# EasyEDA schematic schem.json
TITLE: Sheet_1; REV: 1.0; Date: 2024-05-03; Sheet: 1/1; Drawn By: ramgupta1106; Company: Your Company
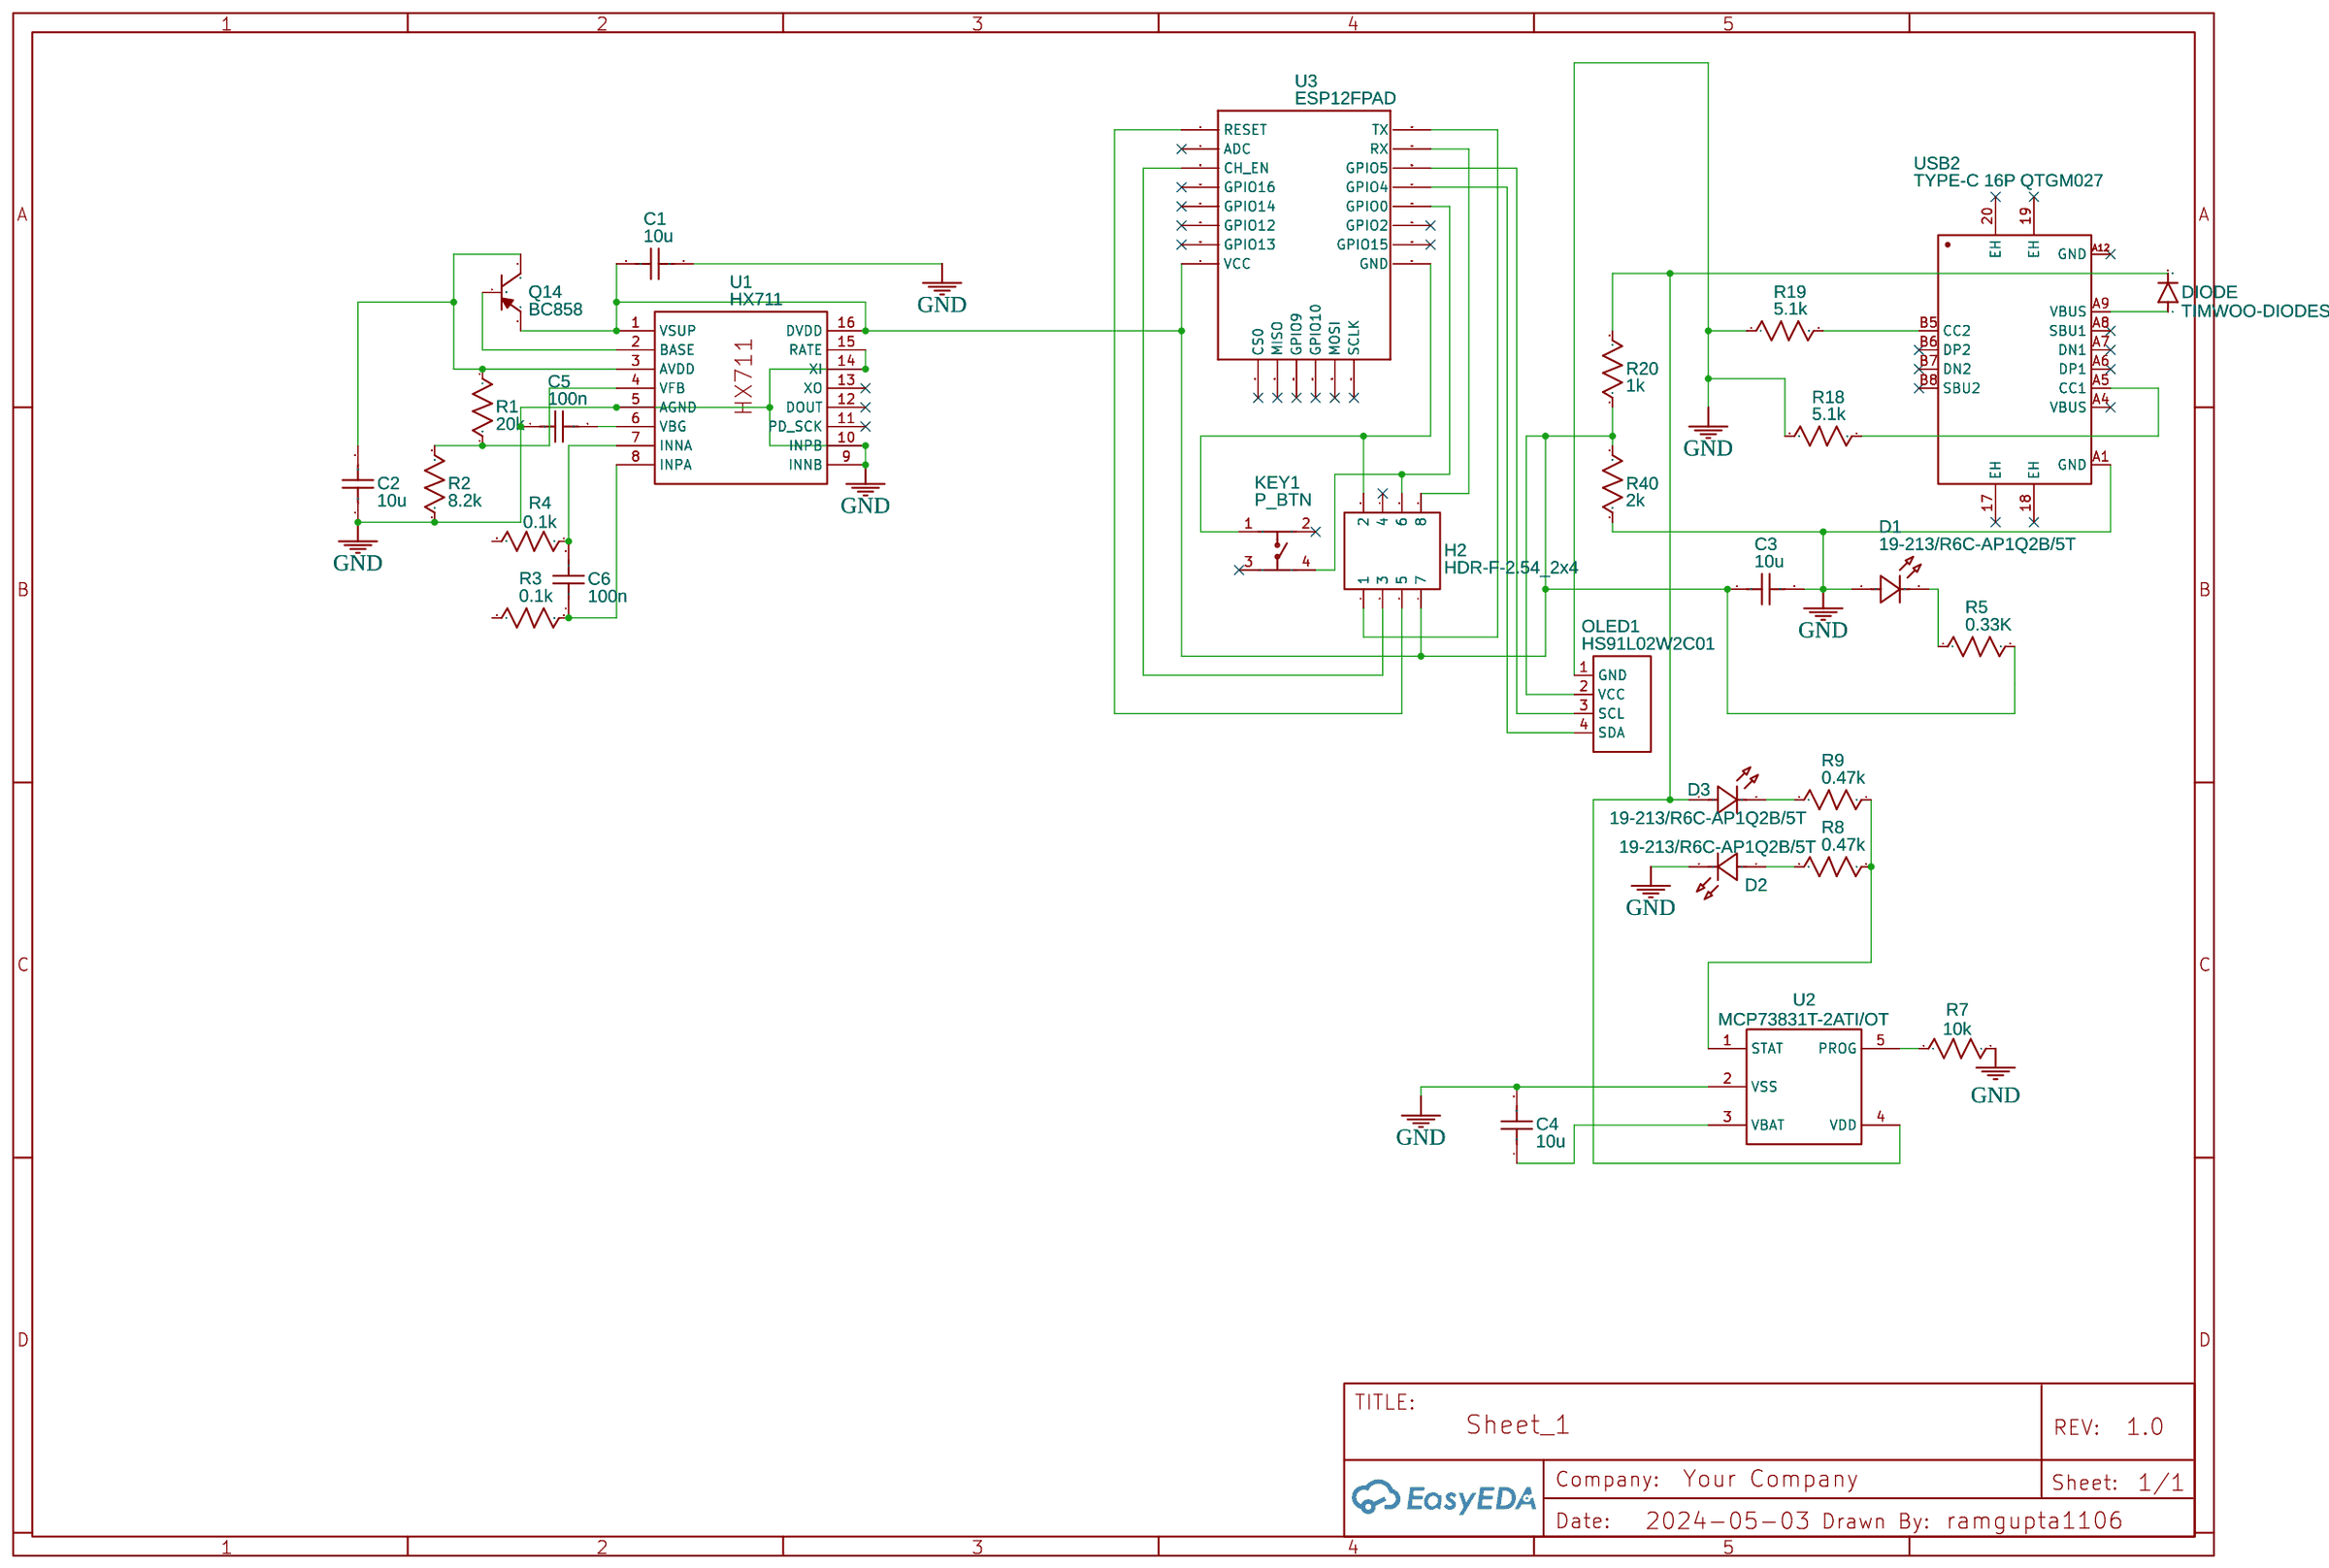
[diagram p0: schematic sheet]

## Parts
C1  10u  [C0603]
C2  10u  [C0603]
C3  10u  [C0603]
C4  10u  [C0603]
C5  100n  [C0603]
C6  100n  [C0603]
D1  19-213/R6C-AP1Q2B/5T  [LED0603-FD]
D2  19-213/R6C-AP1Q2B/5T  [LED0603-FD]
D3  19-213/R6C-AP1Q2B/5T  [LED0603-FD]
DIODE  TIMWOO-DIODES_DIODEHV  [TIMWOO-DIODES_DIODE-HV]
H2  HDR-F-2.54_2x4  [HDR-F-2.54_2X4]
KEY1  P_BTN  [SW-SMD_4P-L6.0-W6.0-P4.50-LS10.0_TL3301EF160QG]
OLED1  HS91L02W2C01  [OLED-TH_L38.0-W12.0_HS91L02W2C01]
Q14  BC858  [SOT-23-3_L2.9-W1.3-P1.90-LS2.4-BR]
R1  20k  [R0603]
R2  8.2k  [R0603]
R3  0.1k  [R0603]
R4  0.1k  [R0603]
R5  0.33K  [R0603]
R7  10k  [R0603]
R8  0.47k  [R0603]
R9  0.47k  [R0603]
R18  5.1k  [R0603]
R19  5.1k  [R0603]
R20  1k  [R0603]
R40  2k  [R0603]
U1  HX711  [SOP-16_L10.0-W3.9-P1.27-LS6.0-BL]
U2  MCP73831T-2ATI/OT  [SOT-23-5_L3.0-W1.7-P0.95-LS2.8-BR]
U3  ESP12FPAD  [ESP12F]
USB2  TYPE-C 16P QTGM027  [USB-C-SMD_TYPE-C-16P-QTGM027]

## Library data of the parts
C1-C6 = C_0603_US: Contributor: LCEDA_Lib
D1-D3 = 19-213/R6C-AP1Q2B/5T: Supplier: LCSC; Supplier Part: C2984264; Manufacturer: EVERLIGHT(亿光); JLCPCB Part Class: Extended Part; Contributor: lcsc
DIODE = TIMWOO-DIODES_DIODEHV: Contributor: moun313131
H2 = HDR-F-2.54_2x4: Supplier Part: C239344; Supplier: LCSC; Contributor: LCEDA_Lib
KEY1 = 4PINTACTPCBTHTPUSHBUTTON: Contributor: LCSC; Supplier: LCSC; Supplier Part: C9900003768; Manufacturer: null; Manufacturer Part: 4pinTACTPCBTHTPushButton; JLCPCB Part Class: Extended Part
OLED1 = HS91L02W2C01: Supplier: LCSC; Supplier Part: C5248081; Manufacturer: HS(汉昇); JLCPCB Part Class: Extended Part; Contributor: lcsc
Q14 = BC858: Contributor: LCSC; Supplier: LCSC; Supplier Part: C692852; Manufacturer: HT(Shenzhen Jinyu Semicon); JLCPCB Part Class: Extended Part
R1-R5 R7-R9 R18-R20 R40 = R_0603_US: Contributor: LCEDA_Lib
U1 = HX711: Supplier: LCSC; Manufacturer: AVIA(海芯科技); Supplier Part: C43656; JLCPCB Part Class: Extended Part
U2 = MCP73831T-2ATI/OT: Supplier: LCSC; Manufacturer: MICROCHIP(美国微芯); Supplier Part: C14879; JLCPCB Part Class: Extended Part
U3 = ESP12FPAD: Contributor: corentindedicast
USB2 = TYPE-C 16P QTGM027: Contributor: LCSC; Supplier: LCSC; Supplier Part: C2681552; Manufacturer: SHOU HAN(首韩); JLCPCB Part Class: Extended Part

## Nets
GND: C1.2 C2.1 C3.2 C4.2 C5.1 D1.1(A) D2.2(K) OLED1.1(GND) R2.1 R7.2 R18.1 R19.1 R40.1 U1.5(AGND) U1.9(INNB) U1.10(INPB) U1.14(XI) U1.15(RATE) U2.2(VSS) USB2.A1(GND)
Net-(C1-1): C1.1 C3.1 H2.7 OLED1.2(VCC) Q14.2(E) R5.2 R20.1 R40.2 U1.1(VSUP) U1.16(DVDD) U3.VCC
Net-(C2-2): C2.2 Q14.3(C) R1.1 U1.3(AVDD)
Net-(C4-1): C4.1 U2.3(VBAT)
Net-(C5-2): C5.2 U1.6(VBG)
Net-(C6-1): C6.1 R3.2 U1.8(INPA)
Net-(C6-2): C6.2 R4.1 U1.7(INNA)
Net-(D1-2): D1.2(K) R5.1
Net-(D2-1): D2.1(A) R8.1
Net-(D3-1): D3.1(A) DIODE.C R20.2 U2.4(VDD)
Net-(D3-2): D3.2(K) R9.1
Net-(DIODE-A): DIODE.A USB2.A9(VBUS)
Net-(H2-1): H2.1 U3.TXD0(TX)
Net-(H2-2): H2.2 KEY1.1 U3.GND
Net-(H2-3): H2.3 U3.CH_PD(CH_EN)
Net-(H2-5): H2.5 U3.RESET
Net-(H2-6): H2.6 KEY1.4 U3.GPIO0
Net-(H2-8): H2.8 U3.RXD0(RX)
Net-(OLED1-3): OLED1.3(SCL) U3.GPIO5
Net-(OLED1-4): OLED1.4(SDA) U3.GPIO4
Net-(Q14-1): Q14.1(B) U1.2(BASE)
Net-(R1-2): R1.2 R2.2 U1.4(VFB)
Net-(R7-1): R7.1 U2.5(PROG)
Net-(R8-2): R8.2 R9.2 U2.1(STAT)
Net-(R18-2): R18.2 USB2.A5(CC1)
Net-(R19-2): R19.2 USB2.B5(CC2)

Not connected (* = marked no-connect by the designer): H2 4*; KEY1 2* 3*; R3 1; R4 2; U1 11(PD_SCK)* 12(DOUT)* 13(XO)*; U3 ADC* CS0* GPIO2* GPIO9* GPIO10* GPIO12* GPIO13* GPIO14* GPIO15* GPIO16* MISO* MOSI* SCLK*; USB2 17(EH)* 18(EH)* 19(EH)* 20(EH)* A4(VBUS)* A6(DP1)* A7(DN1)* A8(SBU1)* A12(GND)* B6(DP2)* B7(DN2)* B8(SBU2)*
